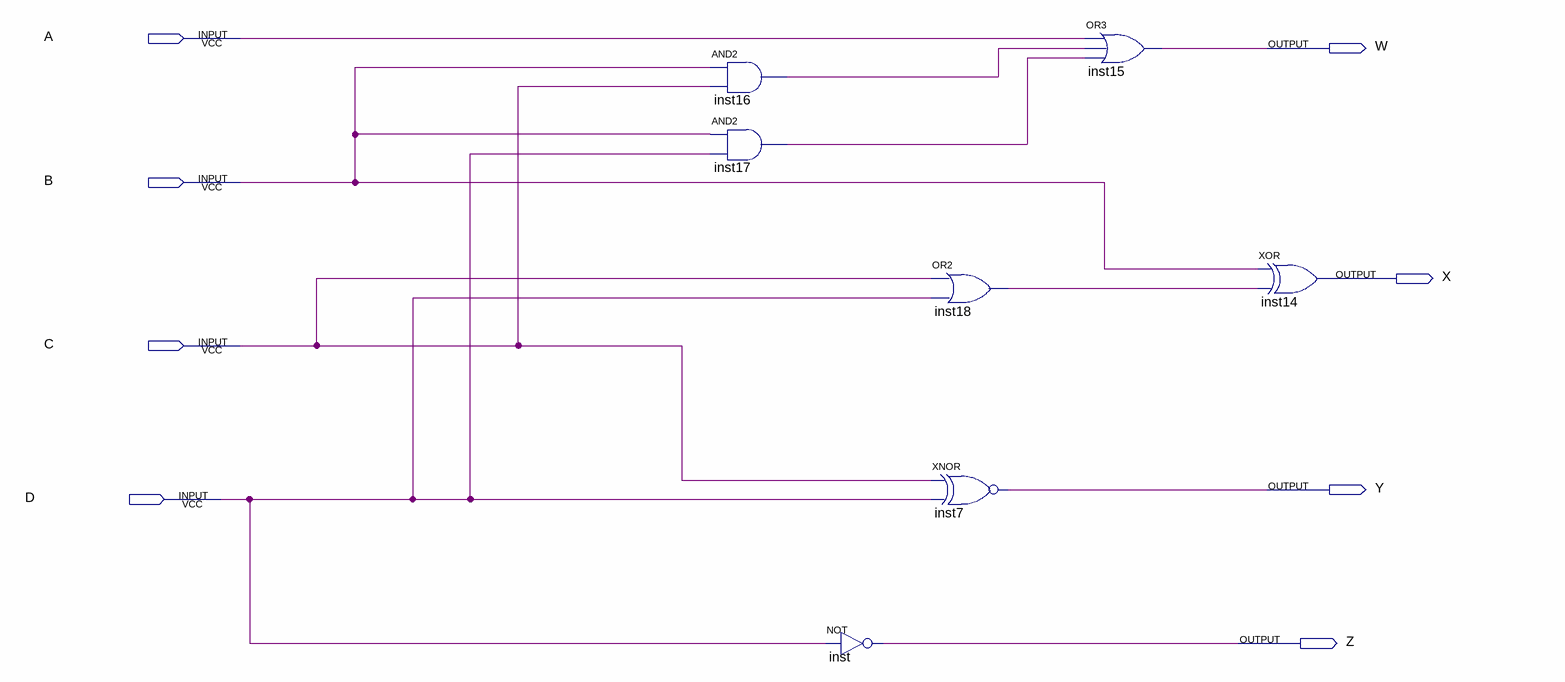
[diagram p0: schematic sheet]
// Quartus schematic 8421.bdf as structural Verilog: 7 symbols, 8 pins
module \8421  (
  input  A,
  input  B,
  input  C,
  input  D,
  output W,
  output X,
  output Y,
  output Z
);

  wire inst16_out, inst17_out, inst18_out;

  and inst16 (inst16_out, B, C);
  and inst17 (inst17_out, B, D);
  not inst (Z, D);
  or inst18 (inst18_out, C, D);
  xnor inst7 (Y, C, D);
  or inst15 (W, A, inst16_out, inst17_out);
  xor inst14 (X, B, inst18_out);
endmodule
